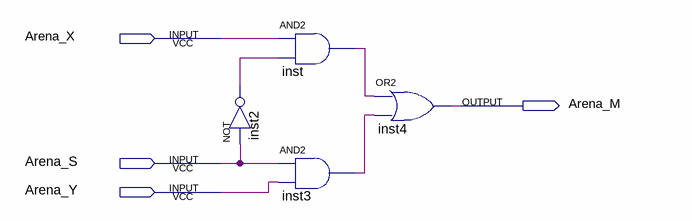
[diagram p0: schematic sheet]
// Quartus schematic Arena_mux2to1.bdf as structural Verilog: 4 symbols, 4 pins
module Arena_mux2to1 (
  input  Arena_X,
  input  Arena_S,
  input  Arena_Y,
  output Arena_M
);

  wire inst2_out, inst3_out, inst_out;

  and inst (inst_out, Arena_X, inst2_out);
  not inst2 (inst2_out, Arena_S);
  and inst3 (inst3_out, Arena_S, Arena_Y);
  or inst4 (Arena_M, inst_out, inst3_out);
endmodule
